# EasyEDA schematic Student_Flight_Board.json
TITLE: Sheet_1; REV: 1.0; Date: 2020-12-20; Sheet: 1/1; Drawn By: jiangje; Company: Your Company
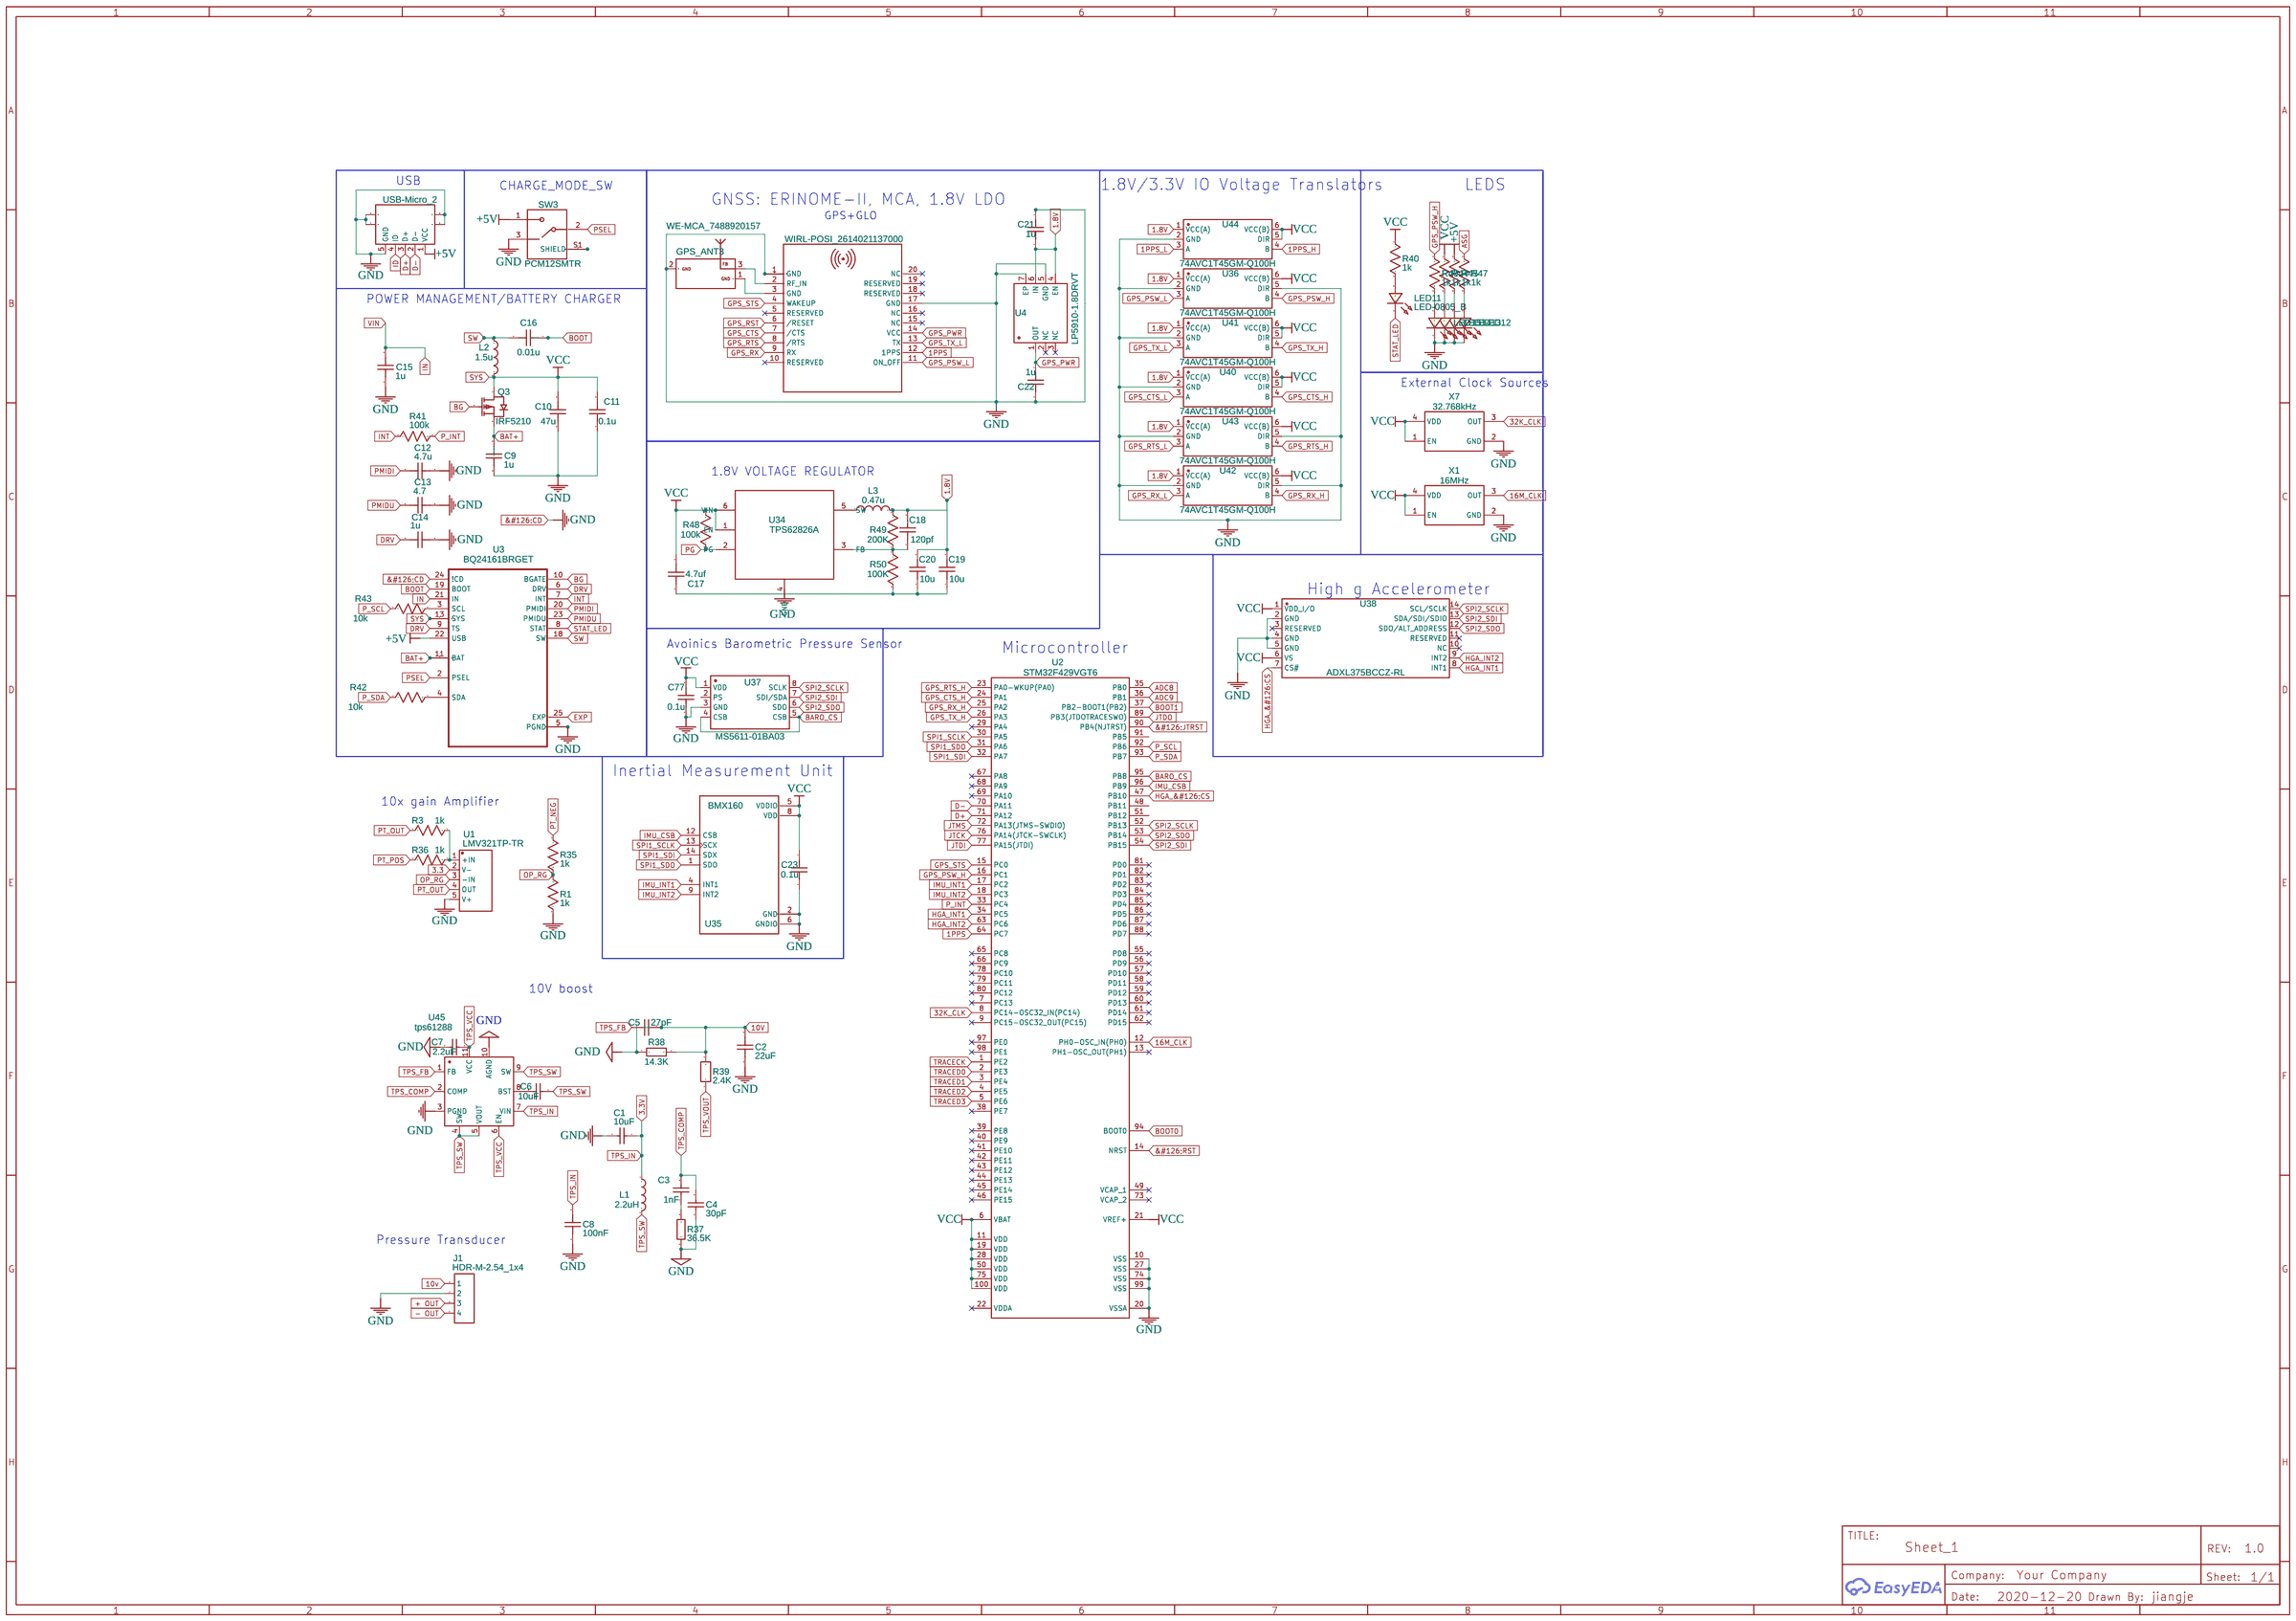
[diagram p0: schematic sheet]

## Parts
1  WIRL-POSI_2614021137000  [WIRL-POSI_2614021137000]
C1  10uF  [C0805]
C2  22uF  [C0805]
C3  1nF  [C0603]
C4  30pF  [C0805]
C5  27pF  [C0603]
C6  10uF  [C0805]
C7  2.2uF  [C0603]
C8  100nF  [C0603]
C9  1u  [C0603]
C10  47u  [C0805]
C11  0.1u  [C0805]
C12  4.7u  [C0603]
C13  4.7  [C0603]
C14  1u  [C0805]
C15  1u  [C0603]
C16  0.01u  [C0805]
C17  4.7uf  [C0805]
C18  120pf  [C0805]
C19  10u  [C0805]
C20  10u  [C0805]
C21  1u  [C0805]
C22  1u  [C0805]
C23  0.1u  [C0805]
C77  0.1u  [C0603]
GPS_ANT3  WE-MCA_7488920157  [WE-MCA_7488920157]
J1  HDR-M-2.54_1x4  [HDR-M-2.54_1X4]
L1  2.2uH  [L0805]
L2  1.5u  [L0603]
L3  0.47u  [L0603]
LED11  LED-0805_B  [LED0805_BLUE]
LED12  LED-0805_G  [LED0805_GREEN]
LED13  LED-0603_R  [LED0603_RED]
LED14  LED-0603_R  [LED0603_RED]
LED15  LED-0603_R  [LED0603_RED]
Q3  IRF5210  [TO-263-2_L10.0-W9.1-P5.08-LS15.2-BR]
R1  1k  [R0603]
R3  1k  [R0603]
R35  1k  [R0603]
R36  1k  [R0603]
R37  36.5K  [R1206]
R38  14.3K  [R1206]
R39  2.4K  [R0402]
R40  1k  [R0603]
R41  100k  [R0603]
R42  10k  [R0603]
R43  10k  [R0603]
R44  1k  [R0603]
R45  1k  [R0603]
R46  1k  [R0603]
R47  1k  [R0603]
R48  100k  [R0603]
R49  200K  [R0603]
R50  100K  [R0603]
SW3  PCM12SMTR  [SW_PCM12SMTR]
U1  LMV321TP-TR  [SOT-23-5_L3.0-W1.7-P0.95-LS2.8-BR]
U2  STM32F429VGT6  [LQFP-100_L14.0-W14.0-P0.50-LS16.0-BL]
U3  BQ24161BRGET  [QFN50P400X400X100-25N]
U4  LP5910-1.8DRVT  [WSON-6_L2.0-W2.0-P0.65-BL-EP]
U34  TPS62826A
U35  BMX160  [PQFN50P250X300X100-14N]
U36  74AVC1T45GM-Q100H  [X2SON-6_L1.0-W0.8-BL]
U37  MS5611-01BA03  [SENSORS-SMD_MS5611-01BA03]
U38  ADXL375BCCZ-RL  [LGA-14_L5.0-W3.0-P0.80-BL]
U40  74AVC1T45GM-Q100H  [X2SON-6_L1.0-W0.8-BL]
U41  74AVC1T45GM-Q100H  [X2SON-6_L1.0-W0.8-BL]
U42  74AVC1T45GM-Q100H  [X2SON-6_L1.0-W0.8-BL]
U43  74AVC1T45GM-Q100H  [X2SON-6_L1.0-W0.8-BL]
U44  74AVC1T45GM-Q100H  [X2SON-6_L1.0-W0.8-BL]
U45  tps61288  [TPS61288]
USB3  USB-Micro_2  [MICRO-USB-SMD_5P_C40957]
X1  16MHz  [ECS-2520S]
X7  32.768kHz  [ECS-2520S]

## Library data of the parts
1 = WIRL-POSI_2614021137000
C1 C6 = CL21A106KPFNNNE: Supplier: LCSC; Manufacturer: SAMSUNG; Supplier Part: C17024
C2 = CL21A226MAQNNNE: Supplier: LCSC; Manufacturer: SAMSUNG; Supplier Part: C45783; SMT Type: Basic; JLCPCB SMD: Yes; LCSC Assembly: Yes
C3 = CL10B102KB8NNNC: Supplier: LCSC; Manufacturer: SAMSUNG; Supplier Part: C1588; SMT Type: Basic; JLCPCB SMD: Yes; LCSC Assembly: Yes
C4 = CL21C300JBANNNC: Supplier: LCSC; Manufacturer: SAMSUNG; Supplier Part: C1809; SMT Type: Basic; JLCPCB SMD: Yes; LCSC Assembly: Yes
C5 = CL10C270JB8NNNC: Supplier: LCSC; Manufacturer: SAMSUNG; Supplier Part: C1656; SMT Type: Basic; JLCPCB SMD: Yes; LCSC Assembly: Yes
C7 = CL10A225KO8NNNC: Supplier: LCSC; Manufacturer: SAMSUNG; Supplier Part: C23630; SMT Type: Basic; JLCPCB SMD: Yes; LCSC Assembly: Yes
C8 = CL10B104KB8NNNC: Supplier: LCSC; Manufacturer: SAMSUNG; Supplier Part: C1591
C9 C12 C13 C15 C77 = C_0603_US: Contributor: LCEDA_Lib
C10 C11 C14 C16-C23 = C_0805_US: Contributor: LCEDA_Lib
GPS_ANT3 = WE-MCA_7488920157
J1 = HDR-M-2.54_1x4: Supplier Part: C124378; Supplier: LCSC; Contributor: LCEDA_Lib
L1 = SCMI201209U2R2KT: Supplier: LCSC; Supplier Part: C479898; Manufacturer: Yanchuang; Contributor: LCSC
L2 L3 = L0603_US: Contributor: LCEDA_Lib
LED11 = LED-0805_B: Manufacturer: 方舟 ARKLED; Manufacturer Part: D-B080508B1-KS2; Supplier Part: C108412; Contributor: LCEDA_Lib
LED12 = LED-0805_G: Manufacturer: 国星光电; Manufacturer Part: NCD0805G1; Supplier Part: C84260; Contributor: LCEDA_Lib
LED13-LED15 = LED-0603_R: Manufacturer: EVERLIGHT(台湾亿光); Manufacturer Part: 19-217/R6C-AL1M2VY/3T; Supplier Part: C72044; Supplier: LCSC; Contributor: LCEDA_01
Q3 = IRF5210: Supplier: LCSC; Manufacturer: IR; Manufacturer Part: IRF5210STRLPBF; image: //image.lceda.cn/szlcsc/C2622.jpg; Supplier Part: C2622; LCSC Assembly: Yes; SMT Type: Extend; Contributor: LCEDA_Lib
R1 R3 R35 R36 R40-R50 = R_0603_US: Contributor: LCEDA_Lib
R37 = CR1206-FX-3652ELF: Supplier: LCSC; Supplier Part: C205346; Manufacturer: BOURNS; Contributor: LCSC
R38 = CR1206-FX-1432ELF: Supplier: LCSC; Supplier Part: C204653; Manufacturer: BOURNS; Contributor: LCSC
R39 = ERJ2GEJ242X: Supplier: LCSC; Supplier Part: C412996; Manufacturer: PANASONIC; Contributor: LCSC
SW3 = PCM12SMTR: Contributor: Ian Scott Paul
U1 = LMV321TP-TR: Supplier: LCSC; Manufacturer: 3PEAK; Supplier Part: C90297; SMT Type: Extend; JLCPCB SMD: Yes; LCSC Assembly: Yes; Assembly Type: smtWeld; Paste Type: expand
U2 = STM32F429VGT6: Supplier: LCSC; Manufacturer: STMicroelectronics; Voltage - Supply: 1.8V ~ 3.6V; Contributor: LCSC; Supplier Part: C95448; SMT Type: Extend; JLCPCB SMD: Yes
U3 = BQ24161BRGET
U4 = LP5910-1.8DRVT: Supplier: LCSC; Manufacturer: TI; Contributor: LCSC; Supplier Part: C139373; SMT Type: Extend; JLCPCB SMD: Yes; LCSC Assembly: Yes
U34 = TPS62826A: Contributor: Lim Xiang Kean
U35 = BMX160
U36 U40-U44 = 74AVC1T45GM-Q100H: Supplier: LCSC; Supplier Part: C546246; Manufacturer: Nexperia; Contributor: LCSC
U37 = MS5611-01BA03: Supplier: LCSC; Manufacturer: MEAS; image: //image.lceda.cn/szlcsc/C37148.jpg; Supplier Part: C37148; LCSC Assembly: Yes; SMT Type: Extend
U38 = ADXL375BCCZ-RL: Supplier: LCSC; Supplier Part: C662206; Manufacturer: Analog Devices; Contributor: LCSC
U45 = tps61288: Contributor: chumengue
USB3 = USB-Micro_2: Supplier Part: C40957; Supplier: LCSC; Manufacturer: ValuePro; Contributor: LCEDA_Lib
X1 X7 = ECS-2520S: Supplier: Mouser; Manufacturer: ECS-2520S33-250-FN-TR; Manufacturer Part: ECS; Contributor: LCSC; Supplier Part: 520-2520S33-250-FNT

## Nets
1.8V: C18.2 C19.2 C20.2 C21.2 L3.2 R49.2 U4.4(EN) U4.6(IN) U36.1(VCC(A)) U40.1(VCC(A)) U41.1(VCC(A)) U42.1(VCC(A)) U43.1(VCC(A)) U44.1(VCC(A))
3.3V: C1.1 C8.2 L1.1 U45.7(VIN)
10v: J1.1
+5V: R45.1 SW3.1 U3.22(USB) USB3.1(VCC)
1PPS: 1.12(1PPS) U2.64(PC7)
1PPS_H: U44.4(B)
1PPS_L: U44.3(A)
3.3: U1.2(V-)
16M_CLK: U2.12(PH0-OSC_IN(PH0)) X1.3(OUT)
32K_CLK: U2.8(PC14-OSC32_IN(PC14)) X7.3(OUT)
&#126;CD: 1.1(GND) 1.17(GND) 1.P$1(GND) 1.P$2(GND) 1.P$3(GND) 1.P$4(GND) 1.P$5(GND) 1.P$6(GND) 1.P$7(GND) 1.P$8(GND) 1.P$9(GND) C1.2 C2.1 C2.2 C4.1 C5.2 C7.1 C8.1 C9.1 C10.1 C11.1 C12.1 C13.1 C14.1 C15.1 C21.1 C22.2 C23.2 C77.1 GPS_ANT3.2(GND1) J1.2 LED12.2 LED13.2 LED14.2 LED15.2 R1.1 R37.1 R38.1 R38.2 R39.2 SW3.3 U1.5(V+) U2.10(VSS) U2.20(VSSA) U2.27(VSS) U2.74(VSS) U2.99(VSS) U3.5(PGND) U3.15(PGND) U3.16(PGND) U3.17(PGND) U3.24(!CD) U4.5(GND) U4.7(EP) U34.4(GND) U35.2(GND) U35.3(GND) U35.6(GNDIO) U35.7(GND) U36.2(GND) U36.5(DIR) U37.3(GND) U38.2(GND) U38.4(GND) U38.5(GND) U40.2(GND) U41.2(GND) U42.2(GND) U42.5(DIR) U43.2(GND) U43.5(DIR) U44.2(GND) U45.3(PGND) U45.10(AGND) USB3.5(GND) USB3.6(SH3) USB3.7(SH4) USB3.8(SH1) USB3.9(SH2) X1.2(GND) X7.2(GND)
&#126;JTRST: U2.90(PB4(NJTRST))
&#126;RST: U2.14(NRST)
+ OUT: J1.3
- OUT: J1.4
ADC8: U2.35(PB0)
ADC9: U2.36(PB1)
ASG: R47.1
BARO_CS: U2.95(PB8) U37.4(CSB) U37.5(CSB)
BAT+: C9.2 Q3.3(S) U3.11(BAT) U3.12(BAT)
BG: Q3.1(G) U3.10(BGATE)
BOOT: C16.1 U3.19(BOOT)
BOOT0: U2.94(BOOT0)
BOOT1: U2.37(PB2-BOOT1(PB2))
D+: U2.71(PA12) USB3.3(D+)
D-: U2.70(PA11) USB3.2(D-)
DRV: C14.2 U3.6(DRV) U3.9(TS)
EXP: U3.25(EXP)
GPS_CTS: 1.7(/CTS)
GPS_CTS_H: U2.24(PA1) U40.4(B)
GPS_CTS_L: U40.3(A)
GPS_PSW_H: R46.1 U2.16(PC1) U36.4(B)
GPS_PSW_L: 1.11(ON_OFF) U36.3(A)
GPS_PWR: 1.14(VCC) C22.1 U4.1(OUT)
GPS_RST: 1.6(/RESET)
GPS_RTS: 1.8(/RTS)
GPS_RTS_H: U2.23(PA0-WKUP(PA0)) U43.4(B)
GPS_RTS_L: U43.3(A)
GPS_RX: 1.9(RX)
GPS_RX_H: U2.25(PA2) U42.4(B)
GPS_RX_L: U42.3(A)
GPS_STS: 1.4(WAKEUP) U2.15(PC0)
GPS_TX_H: U2.26(PA3) U41.4(B)
GPS_TX_L: 1.13(TX) U41.3(A)
HGA_&#126;CS: U2.47(PB10) U38.7(CS#)
HGA_INT1: U2.34(PC5) U38.8(INT1)
HGA_INT2: U2.63(PC6) U38.9(INT2)
ID: USB3.4(ID)
IMU_CSB: U2.96(PB9) U35.12(CSB)
IMU_INT1: U2.17(PC2) U35.4(INT1)
IMU_INT2: U2.18(PC3) U35.9(INT2)
IN: C15.2 U3.21(IN)
INT: R41.1 U3.7(INT)
JTCK: U2.76(PA14(JTCK-SWCLK))
JTDI: U2.77(PA15(JTDI))
JTDO: U2.89(PB3(JTDOTRACESWO))
JTMS: U2.72(PA13(JTMS-SWDIO))
OP_RG: R1.2 R35.2 U1.3(-IN)
P_INT: R41.2 U2.33(PC4)
P_SCL: R43.1 U2.92(PB6)
P_SDA: R42.1 U2.93(PB7)
PG: R48.1 U34.2(PG)
PMIDI: C12.2 U3.20(PMIDI)
PMIDU: C13.2 U3.23(PMIDU)
PSEL: SW3.2 U3.2(PSEL)
PT_NEG: R35.1
PT_OUT: R3.1 U1.4(OUT)
PT_POS: R36.1
SPI1_SCLK: U2.30(PA5) U35.13(SCX)
SPI1_SDI: U2.32(PA7) U35.14(SDX)
SPI1_SDO: U2.31(PA6) U35.1(SDO)
SPI2_SCLK: U2.52(PB13) U37.8(SCLK) U38.14(SCL/SCLK)
SPI2_SDI: U2.54(PB15) U37.7(SDI/SDA) U38.13(SDA/SDI/SDIO)
SPI2_SDO: U2.53(PB14) U37.6(SDO) U38.12(SDO/ALT ADDRESS)
STAT_LED: LED11.2 U3.8(STAT)
SW: C16.2 L2.1 U3.18(SW)
SYS: C10.2 C11.2 C17.2 C23.1 C77.2 L2.2 Q3.4(D) R40.1 R44.1 R48.2 U2.6(VBAT) U2.11(VDD) U2.19(VDD) U2.21(VREF+) U2.28(VDD) U2.50(VDD) U2.75(VDD) U2.100(VDD) U3.13(SYS) U3.14(SYS) U34.1(EN) U34.6(VIN) U35.5(VDDIO) U35.8(VDD) U36.6(VCC(B)) U37.1(VDD) U38.1(VDD I/O) U38.6(VS) U40.5(DIR) U40.6(VCC(B)) U41.5(DIR) U41.6(VCC(B)) U42.6(VCC(B)) U43.6(VCC(B)) U44.5(DIR) U44.6(VCC(B)) X1.1(EN) X1.4(VDD) X7.1(EN) X7.4(VDD)
TPS_COMP: C3.2 C4.2 U45.2(COMP)
TPS_FB: C5.1 U45.1(FB)
TPS_SW: C6.2 L1.2 U45.4(SW) U45.5(VOUT) U45.9(SW)
TPS_VCC: C7.2 U45.6(EN) U45.11(VCC)
TPS_VOUT: R39.1
TRACECK: U2.1(PE2)
TRACED0: U2.2(PE3)
TRACED1: U2.3(PE4)
TRACED2: U2.4(PE5)
TRACED3: U2.5(PE6)
Net-(1-2): 1.2(RF_IN) GPS_ANT3.3(FEED)
Net-(1-3): 1.3(GND) GPS_ANT3.1(GND)
Net-(C3-1): C3.1 R37.2
Net-(C6-1): C6.1 U45.8(BST)
Net-(C17-1): C17.1 C19.1 C20.1 R50.1
Net-(C18-1): C18.1 R49.1 R50.2 U34.3(FB)
Net-(L3-1): L3.1 U34.5(SW)
Net-(LED11-1): LED11.1 R40.2
Net-(LED12-1): LED12.1 R47.2
Net-(LED13-1): LED13.1 R45.2
Net-(LED14-1): LED14.1 R44.2
Net-(LED15-1): LED15.1 R46.2
Net-(R3-2): R3.2 R36.2 U1.1(+IN)
Net-(R42-2): R42.2 U3.4(SDA)
Net-(R43-2): R43.2 U3.3(SCL)
Net-(SW3-S1): SW3.S1(SHIELD) SW3.S2(SHIELD) SW3.S3(SHIELD) SW3.S4(SHIELD)

Not connected (* = marked no-connect by the designer): 1 5(RESERVED)* 10(RESERVED)* 15(NC)* 16(NC)* 18(RESERVED)* 19(RESERVED)* 20(NC)*; U2 7(PC13)* 9(PC15-OSC32_OUT(PC15))* 13(PH1-OSC_OUT(PH1))* 22(VDDA)* 29(PA4)* 38(PE7)* 39(PE8)* 40(PE9)* 41(PE10)* 42(PE11)* 43(PE12)* 44(PE13)* 45(PE14)* 46(PE15)* 48(PB11) 49(VCAP_1)* 51(PB12) 55(PD8)* 56(PD9)* 57(PD10)* 58(PD11)* 59(PD12)* 60(PD13)* 61(PD14)* 62(PD15)* 65(PC8)* 66(PC9)* 67(PA8)* 68(PA9)* 69(PA10)* 73(VCAP_2)* 78(PC10)* 79(PC11)* 80(PC12)* 81(PD0)* 82(PD1)* 83(PD2)* 84(PD3)* 85(PD4)* 86(PD5)* 87(PD6)* 88(PD7)* 91(PB5) 97(PE0)* 98(PE1)*; U4 2(NC)* 3(NC)*; U37 2(PS); U38 3(RESERVED)* 10(NC)* 11(RESERVED)*

## Notes on the sheet
- USB
- CHARGE_MODE_SW
- 1.8V/3.3V IO Voltage Translators
- LEDS
- GNSS: ERINOME-II, MCA, 1.8V LDO
- GPS+GLO
- POWER MANAGEMENT/BATTERY CHARGER
- External Clock Sources
- 1.8V VOLTAGE REGULATOR
- High g Accelerometer
- Avoinics Barometric Pressure Sensor
- Microcontroller
- Inertial Measurement Unit
- 10x gain Amplifier
- 10V boost
- Pressure Transducer
